# Altium project Kay Tremolo.PrjPcb
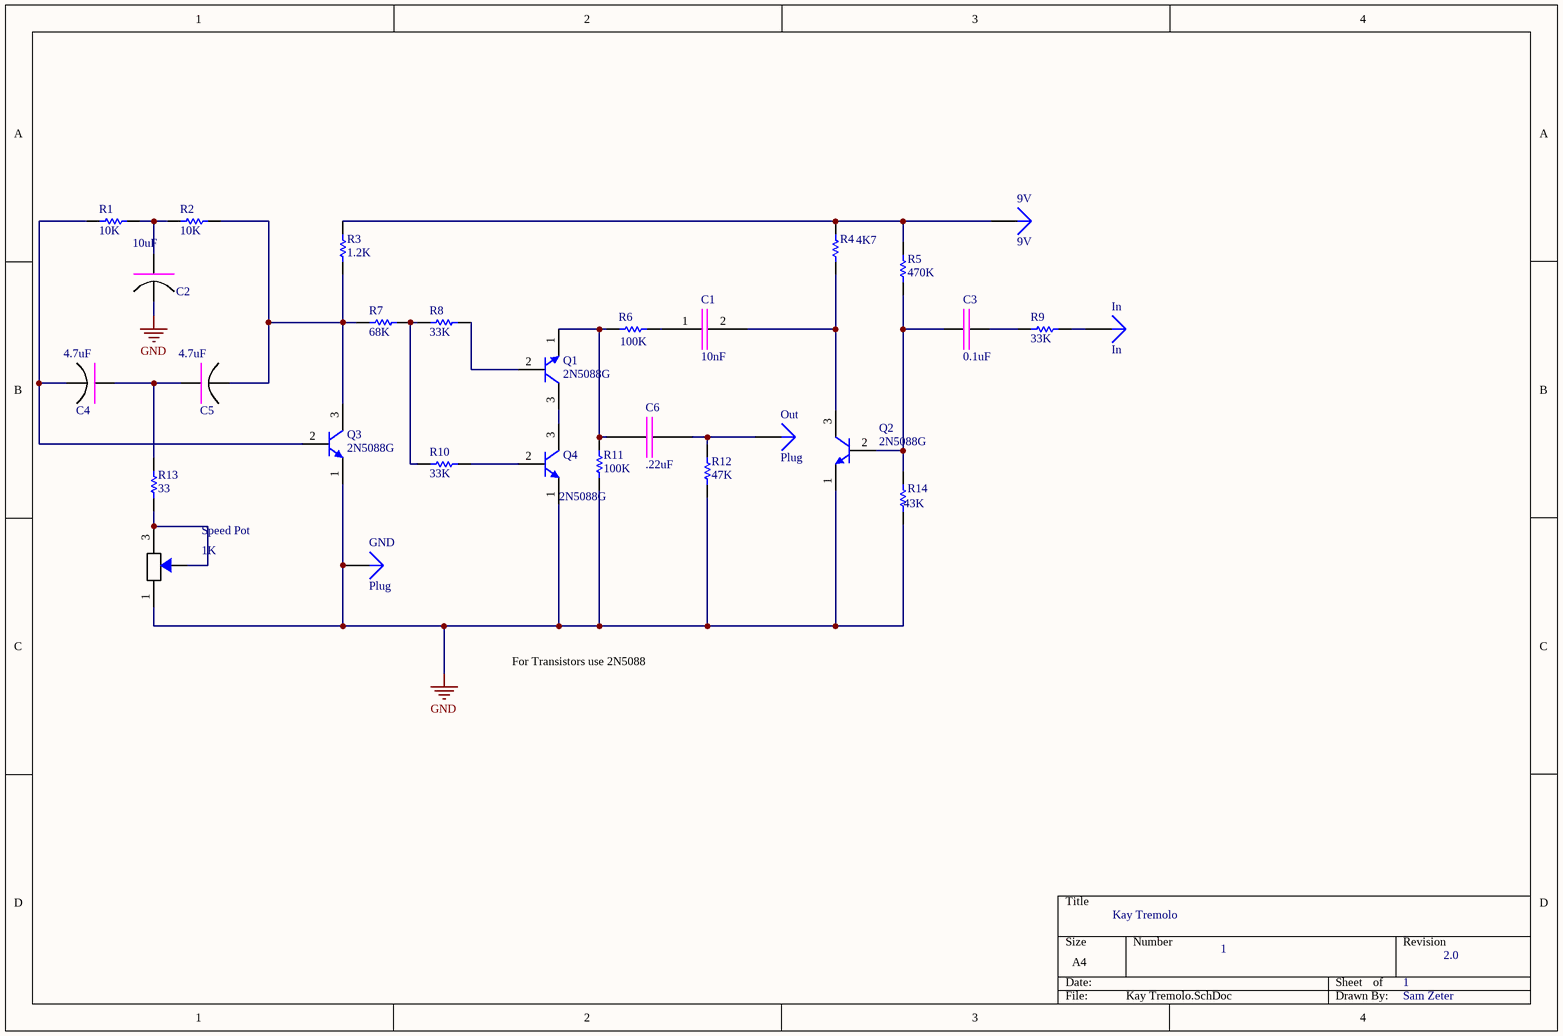
[diagram p0: Kay Tremolo.SchDoc]
1 sheet, 29 parts. Net scope: global (net labels, ports and power ports of the same name join across sheets).
Board file: Kay_PCB.PcbDoc

## Sheet Kay Tremolo.SchDoc
size A4

### Parts
9V  9V  [PIN1]
C1  10nF  [CapCer 2.5]
C2  10uF  [CapElec 2]
C3  0.1uF  [CapCer 5]
C4  4.7uF  [CapElec 2]
C5  4.7uF  [CapElec 2]
C6  .22uF  [CapCer 5]
GND  Plug  [PIN1]
In  In  [PIN1]
Out  Plug  [PIN1]
Q1  2N5088G  [ONSC-TO-92-3-29-11]
Q2  2N5088G  [ONSC-TO-92-3-29-11]
Q3  2N5088G  [ONSC-TO-92-3-29-11]
Q4  2N5088G  [ONSC-TO-92-3-29-11]
R1  10K  [Axial 0.4]
R2  10K  [Axial 0.4]
R3  1.2K  [Axial 0.4]
R4  4K7  [Axial 0.4]
R5  470K  [Axial 0.4]
R6  100K  [Axial 0.4]
R7  68K  [Axial 0.4]
R8  33K  [Axial 0.4]
R9  33K  [Axial 0.4]
R10  33K  [Axial 0.4]
R11  100K  [Axial 0.4]
R12  47K  [Axial 0.4]
R13  33  [Axial 0.4]
R14  43K  [Axial 0.4]
Speed_Pot  1K  [Potentiometer]

### Nets
GND: C2.2 GND.1 Q2.1(E) Q3.1(E) Q4.1(E) R11.1 R12.1 R14.1 Speed_Pot.1
Net9V_1: 9V.1 R3.2 R4.1 R5.1
NetC1_1: C1.1 R6.2
NetC1_2: C1.2 Q2.3(C) R4.2
NetC2_1: C2.1 R1.2 R2.1
NetC3_1: C3.1 Q2.2(B) R5.2 R14.2
NetC3_2: C3.2 R9.2
NetC4_1: C4.1 C5.1 R13.1
NetC4_2: C4.2 Q3.2(B) R1.1
NetC5_2: C5.2 Q3.3(C) R2.2 R3.1 R7.2
NetC6_1: C6.1 Q1.1(E) R6.1 R11.2
NetC6_2: C6.2 Out.1 R12.2
NetIn_1: In.1 R9.1
NetQ1_2: Q1.2(B) R8.1
NetQ1_3: Q1.3(C) Q4.3(C)
NetQ4_2: Q4.2(B) R10.1
NetR7_1: R7.1 R8.2 R10.2
NetR13_2: R13.2 Speed_Pot.2 Speed_Pot.3

### Notes on the sheet
- For Transistors use 2N5088
- Kay Tremolo
- 1
- 2.0
- Sam Zeter

### Library data of the parts
9V In = Plug: LatestRevisionDate: 17-Jul-2002; LatestRevisionNote: Re-released for DXP Platform.; Publisher: Altium Limited
C1 = CapCer 2.5mm: Ceramic Capactiro 2.5mm spaced leads
C2 C4 C5 = CapElec 2mm: 2mm Lead Spaced Electro Cap
C3 C6 = CapCer 5mm: 5mm Spaced Ceramic Capacitor Leads
Q1-Q4 = 2N5088G: Amplifier Transistor, NPN Silicon, 3-Pin TO-92, Pb-Free, Bulk Box; Manufacturer: On Semiconductor; fT Min (MHz): 50; IC Continuous (A): 0.05; DatasheetVersion: Rev. 4; PackageVersion: Rev. AM; PackageReference: TO-92-3-29-11_AM_SL; PackageDescription: 3-Pin Transistor Outline, Body 4.825 x 3.685 mm, Pitch 1.27 mm; Supplier 1: Newark; Supplier Part Number 1: 42K3133; Supplier 2: Mouser; Supplier Part Number 2: 863-2N5088G; Packing: Bulk Box; Polarity: NPN; RoHS: TRUE; Mounting Technology: Through Hole; PartNumber: 2N5088G; ComponentLink1Description: Manufacturer URL; ComponentLink1URL: http://www.onsemi.com/; ComponentLink2Description: Datasheet; ComponentLink2URL: http://www.onsemi.com/pub_link/Collateral/2N5088-D.PDF; ComponentLink3Description: Package Specification; ComponentLink3URL: http://www.onsemi.cn/pub_link/Collateral/2N6426-D.PDF
R1 R2 R5-R14 = Res 0.4: TH Resistor 1/4 WATT; Published: 8-Jun-2000; LatestRevisionDate: 17-Jul-2002; LatestRevisionNote: Re-released for DXP Platform.; PackageReference: AXIAL-0.3; Publisher: Altium Limited; PackageDescription: Axial Device, Thru-Hole; 2 Leads; 0.3 in Pin Spacing
  R1 R2: Value: 10K
  R5: Value: 470K
  R6 R11: Value: 100K
  R7: Value: 68K
  R8-R10: Value: 33K
  R12: Value: 47K
  R13: Value: 33
  R14: Value: 43K
R3 = Res 0.4: TH Resistor 1/4 WATT; Value: 1K; Published: 8-Jun-2000; LatestRevisionDate: 17-Jul-2002; LatestRevisionNote: Re-released for DXP Platform.; PackageReference: AXIAL-0.3; Publisher: Altium Limited; PackageDescription: Axial Device, Thru-Hole; 2 Leads; 0.3 in Pin Spacing
R4 = Res 0.4: TH Resistor 1/4 WATT; Value: 4.7K; Published: 8-Jun-2000; LatestRevisionDate: 17-Jul-2002; LatestRevisionNote: Re-released for DXP Platform.; PackageReference: AXIAL-0.3; Publisher: Altium Limited; PackageDescription: Axial Device, Thru-Hole; 2 Leads; 0.3 in Pin Spacing
Speed_Pot = Potentiometer_1: My Own
GND Out = Plug: LatestRevisionDate: 17-Jul-2002; LatestRevisionNote: Re-released for DXP Platform.; Publisher: Altium Limited